# EAGLE board UCirKitBreadboardWithEverything2Top (EAGLE 7.3.0), part 1 of 2
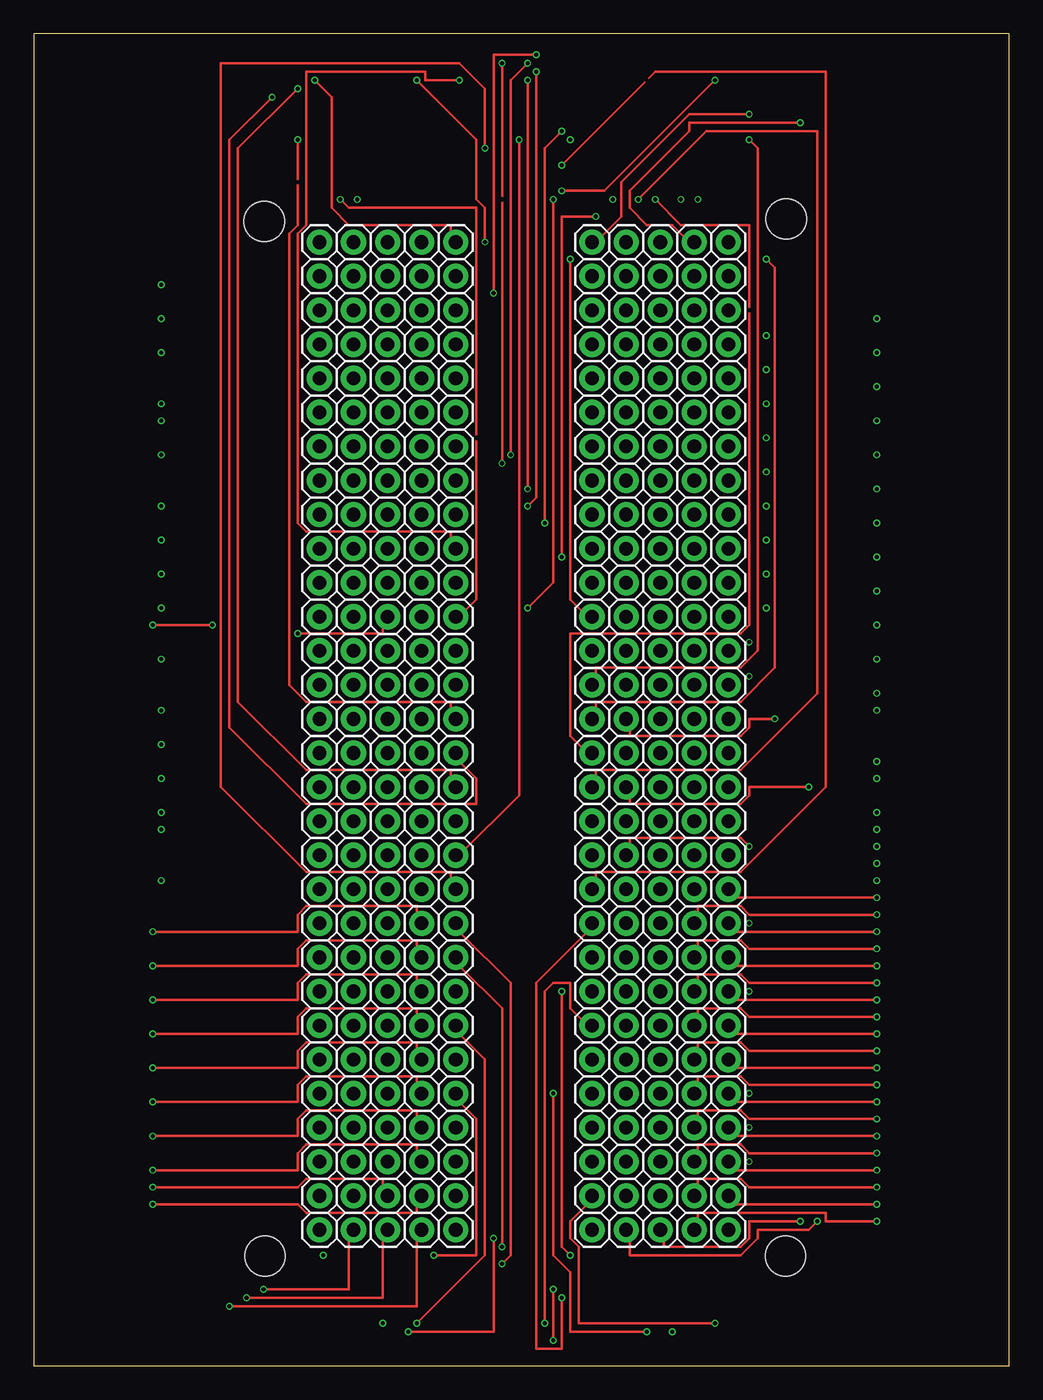
[diagram p2: board, top side]
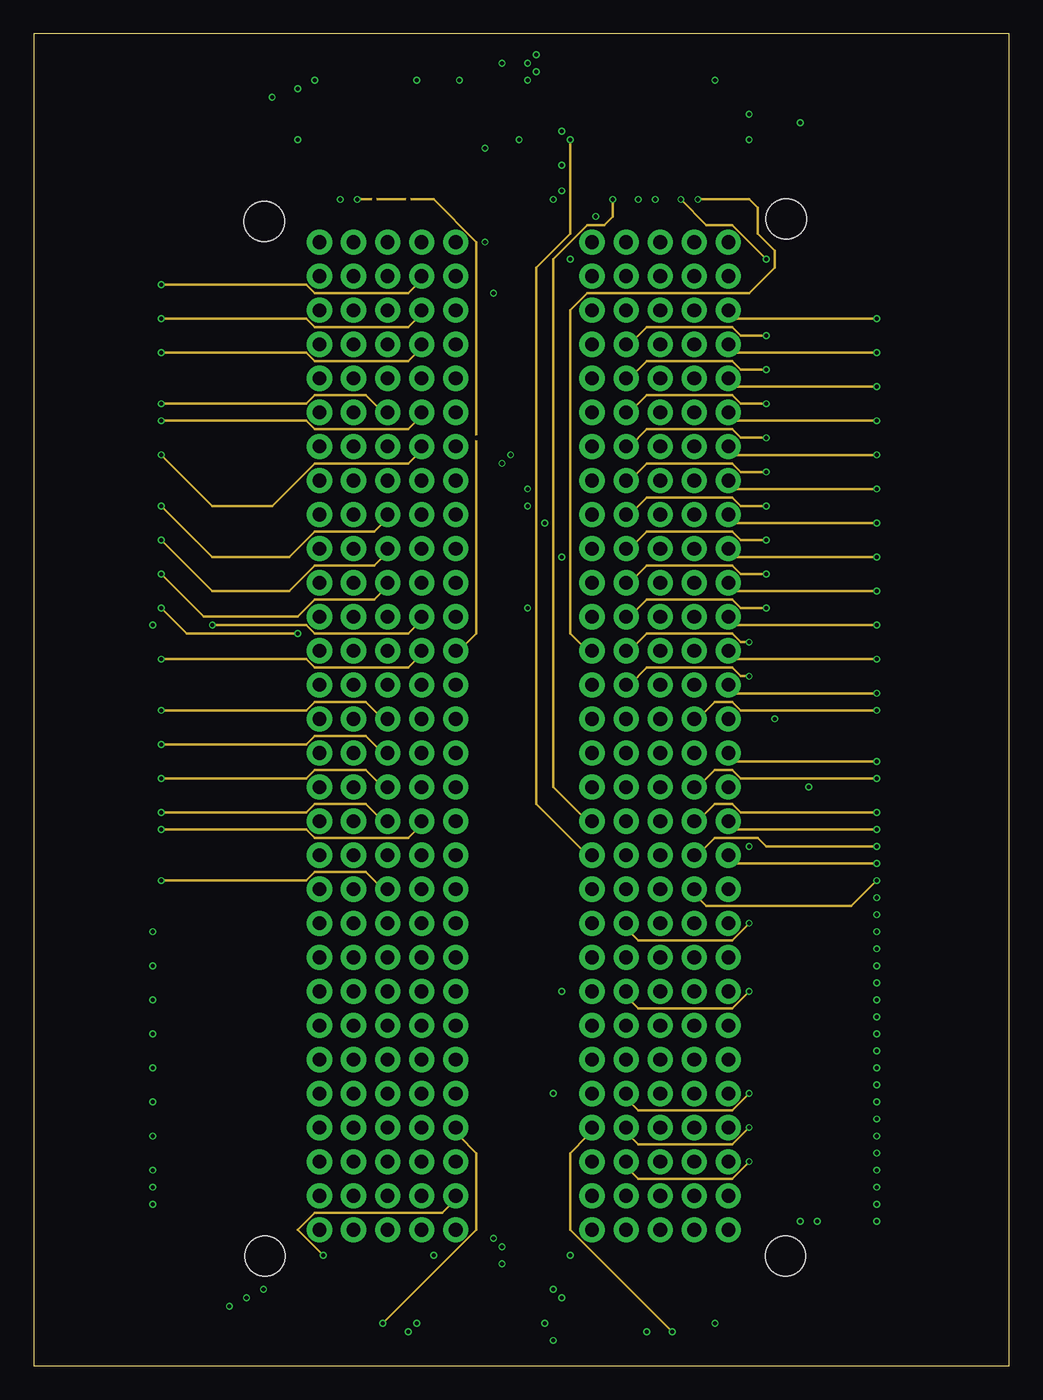
[diagram p3: board, inner layer Route2]
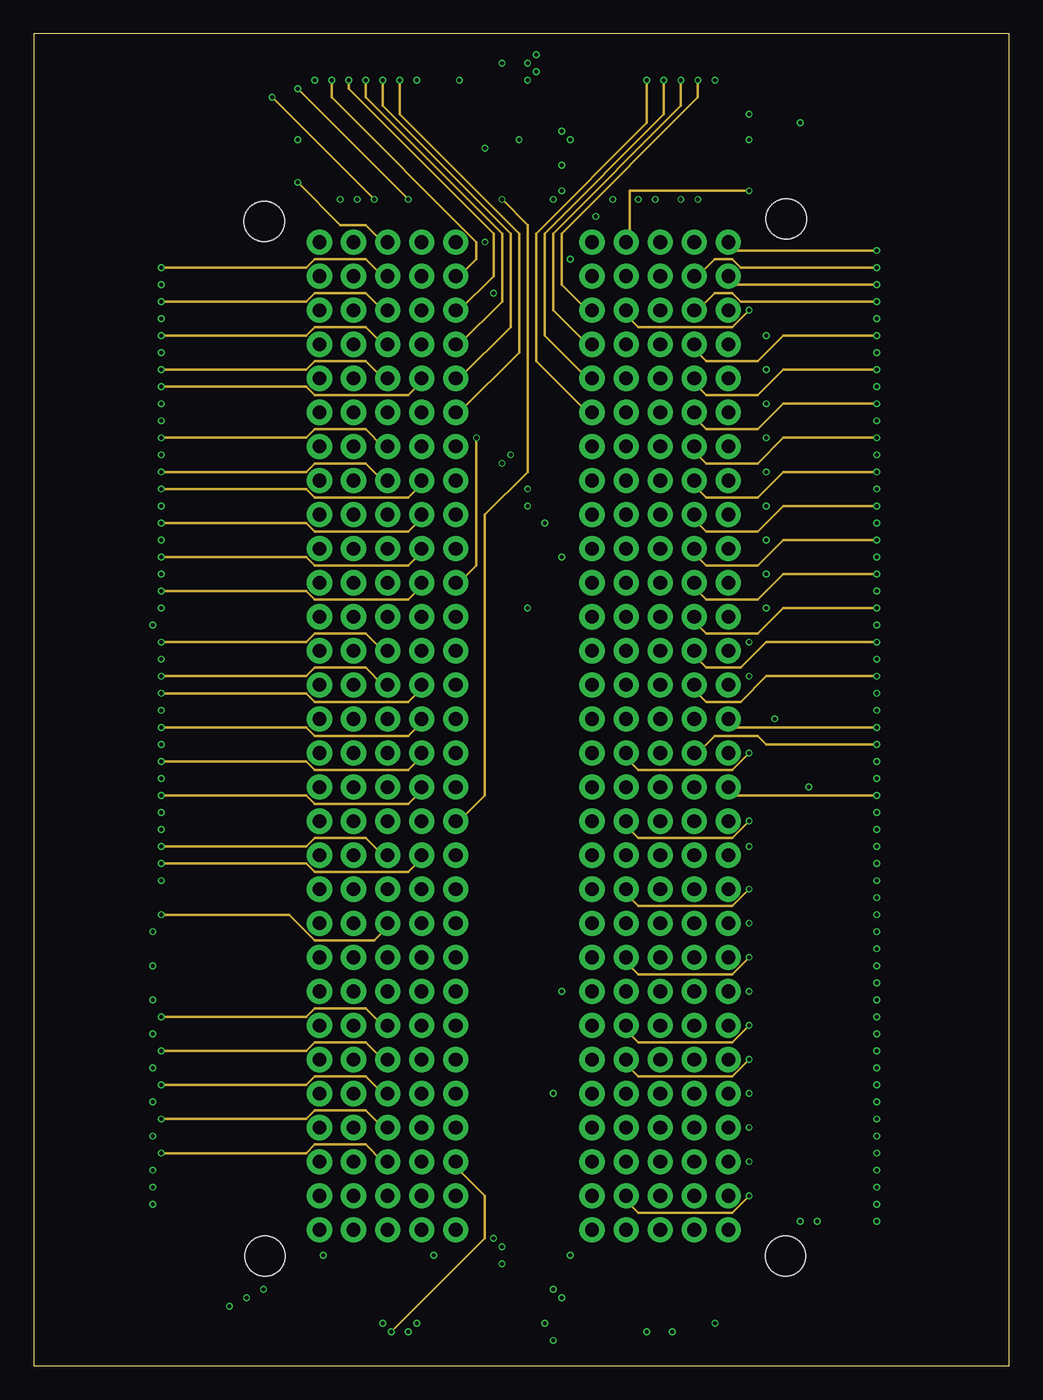
[diagram p4: board, inner layer Route15]
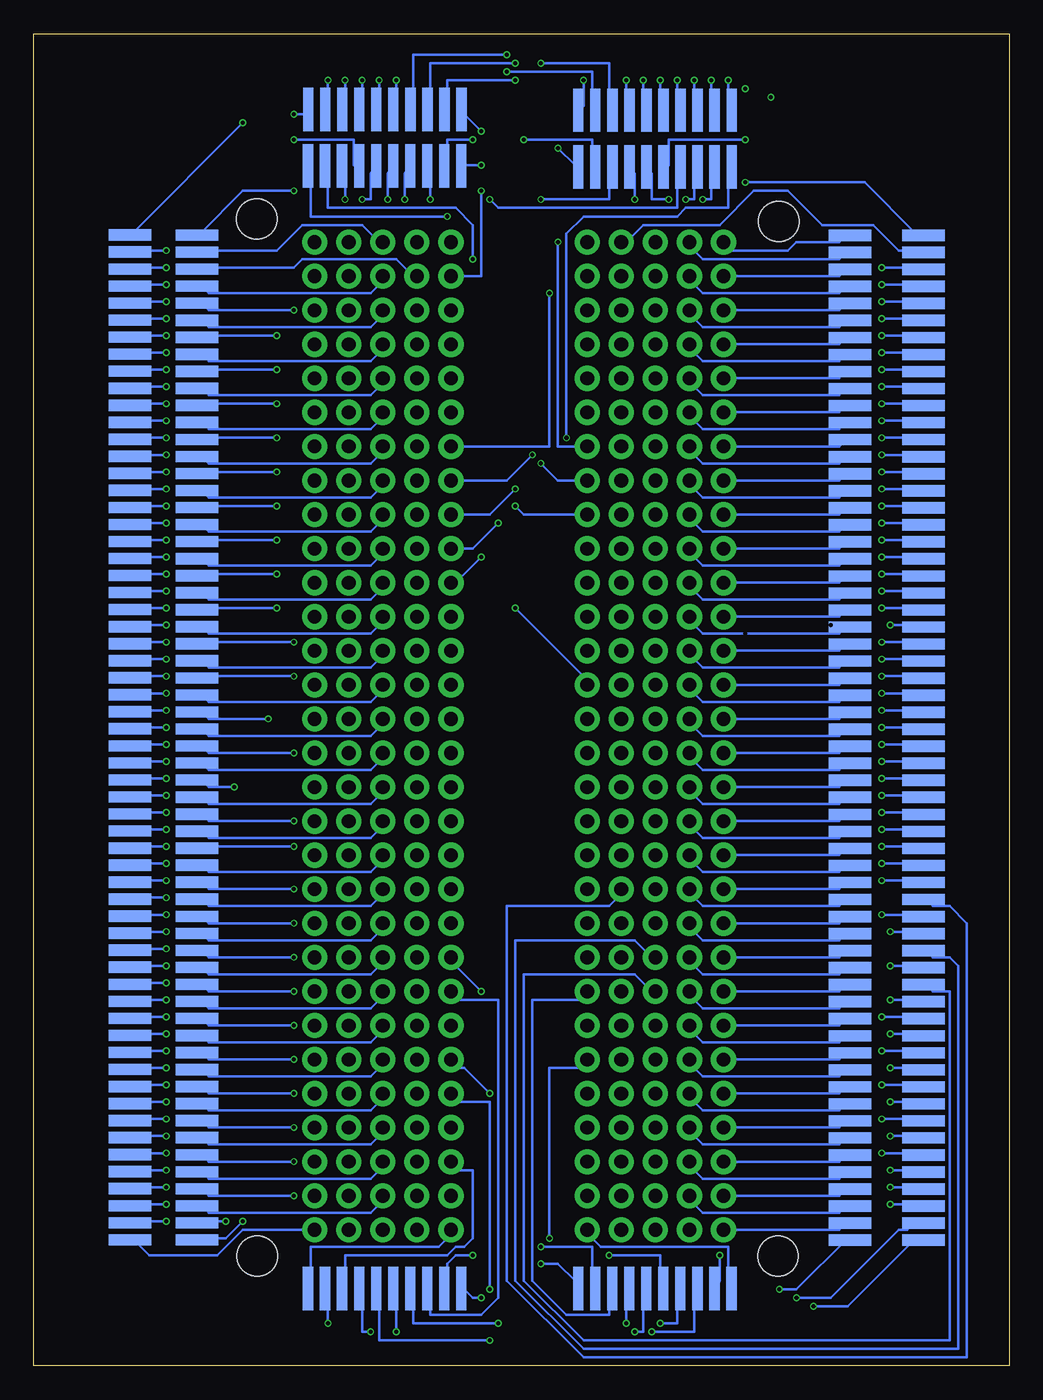
[diagram p5: board, bottom side, seen from below]

Size 72.75 x 99.36 mm. Coordinates in mm from the lower left corner, seen from the top.
Outline: 0,0 72.75,0 72.75,99.36 0,99.36 0,0
Copper layers [2:(1*(2*15)*16):15]: Top 0.035mm / dielectric 0.2mm / Route2 0.0175mm / dielectric 0.3mm / Route15 0.0175mm / dielectric 0.2mm / Bottom 0.035mm
Design rules "SeeedStudio_4layer_DRU_no_angle_20140221 *": minimum track width 8mil, minimum drill 12mil, track to track 8mil, track to pad 8mil, pad to pad 8mil, via to via 8mil, smd to smd 0mil, copper to edge 10mil, drill to drill 8mil, minimum pad ring 6mil, minimum via ring 4mil, stop-mask expansion 4mil, vias tented up to drill 100mil, thermal gap 10mil
Holes 3 mm at 56.11,85.53 17.2,85.34 17.24,8.21 56.07,8.21

## Footprints (pad centres in the part's own frame; a part is rotated, then mirrored left to right if it is on the bottom)
1X01_WITHOUT_TEXT = drill 1.016 pad 1.88: 1 0,0
1X01_SMD_3.25X0.85MM_NO_SILK = smd 3.25 x 0.85: P$3 0,0

## Placement (x,y rotation side)
CLEAN0  [1X01_WITHOUT_TEXT]  21.32,83.81 0 top
CLEAN1  [1X01_WITHOUT_TEXT]  23.86,83.81 0 top
CLEAN2  [1X01_WITHOUT_TEXT]  26.39,83.81 0 top
CLEAN3  [1X01_WITHOUT_TEXT]  28.93,83.81 0 top
CLEAN4  [1X01_WITHOUT_TEXT]  31.48,83.81 0 top
CLEAN5  [1X01_WITHOUT_TEXT]  41.63,83.81 0 top
CLEAN6  [1X01_WITHOUT_TEXT]  44.17,83.81 0 top
CLEAN7  [1X01_WITHOUT_TEXT]  46.72,83.81 0 top
CLEAN8  [1X01_WITHOUT_TEXT]  49.26,83.81 0 top
CLEAN9  [1X01_WITHOUT_TEXT]  51.8,83.81 0 top
CLEAN10  [1X01_WITHOUT_TEXT]  21.32,81.27 0 top
CLEAN11  [1X01_WITHOUT_TEXT]  23.86,81.27 0 top
CLEAN12  [1X01_WITHOUT_TEXT]  26.39,81.27 0 top
CLEAN13  [1X01_WITHOUT_TEXT]  28.93,81.27 0 top
CLEAN14  [1X01_WITHOUT_TEXT]  31.48,81.27 0 top
CLEAN15  [1X01_WITHOUT_TEXT]  41.63,81.27 0 top
CLEAN16  [1X01_WITHOUT_TEXT]  44.17,81.27 0 top
CLEAN17  [1X01_WITHOUT_TEXT]  46.72,81.27 0 top
CLEAN18  [1X01_WITHOUT_TEXT]  49.26,81.27 0 top
CLEAN19  [1X01_WITHOUT_TEXT]  51.8,81.27 0 top
CLEAN20  [1X01_WITHOUT_TEXT]  21.32,78.73 0 top
CLEAN21  [1X01_WITHOUT_TEXT]  23.86,78.73 0 top
CLEAN22  [1X01_WITHOUT_TEXT]  26.39,78.73 0 top
CLEAN23  [1X01_WITHOUT_TEXT]  28.93,78.73 0 top
CLEAN24  [1X01_WITHOUT_TEXT]  31.48,78.73 0 top
CLEAN25  [1X01_WITHOUT_TEXT]  41.63,78.73 0 top
CLEAN26  [1X01_WITHOUT_TEXT]  44.17,78.73 0 top
CLEAN27  [1X01_WITHOUT_TEXT]  46.72,78.73 0 top
CLEAN28  [1X01_WITHOUT_TEXT]  49.26,78.73 0 top
CLEAN29  [1X01_WITHOUT_TEXT]  51.8,78.73 0 top
CLEAN30  [1X01_WITHOUT_TEXT]  21.32,76.19 0 top
CLEAN31  [1X01_WITHOUT_TEXT]  23.86,76.19 0 top
CLEAN32  [1X01_WITHOUT_TEXT]  26.39,76.19 0 top
CLEAN33  [1X01_WITHOUT_TEXT]  28.93,76.19 0 top
CLEAN34  [1X01_WITHOUT_TEXT]  31.48,76.19 0 top
CLEAN35  [1X01_WITHOUT_TEXT]  41.63,76.19 0 top
CLEAN36  [1X01_WITHOUT_TEXT]  44.17,76.19 0 top
CLEAN37  [1X01_WITHOUT_TEXT]  46.72,76.19 0 top
CLEAN38  [1X01_WITHOUT_TEXT]  49.26,76.19 0 top
CLEAN39  [1X01_WITHOUT_TEXT]  51.8,76.19 0 top
CLEAN40  [1X01_WITHOUT_TEXT]  21.32,73.65 0 top
CLEAN41  [1X01_WITHOUT_TEXT]  23.86,73.65 0 top
CLEAN42  [1X01_WITHOUT_TEXT]  26.39,73.65 0 top
CLEAN43  [1X01_WITHOUT_TEXT]  28.93,73.65 0 top
CLEAN44  [1X01_WITHOUT_TEXT]  31.48,73.65 0 top
CLEAN45  [1X01_WITHOUT_TEXT]  41.63,73.65 0 top
CLEAN46  [1X01_WITHOUT_TEXT]  44.17,73.65 0 top
CLEAN47  [1X01_WITHOUT_TEXT]  46.72,73.65 0 top
CLEAN48  [1X01_WITHOUT_TEXT]  49.26,73.65 0 top
CLEAN49  [1X01_WITHOUT_TEXT]  51.8,73.65 0 top
CLEAN50  [1X01_WITHOUT_TEXT]  21.32,71.11 0 top
CLEAN51  [1X01_WITHOUT_TEXT]  23.86,71.11 0 top
CLEAN52  [1X01_WITHOUT_TEXT]  26.39,71.11 0 top
CLEAN53  [1X01_WITHOUT_TEXT]  28.93,71.11 0 top
CLEAN54  [1X01_WITHOUT_TEXT]  31.48,71.11 0 top
CLEAN55  [1X01_WITHOUT_TEXT]  41.63,71.11 0 top
CLEAN56  [1X01_WITHOUT_TEXT]  44.17,71.11 0 top
CLEAN57  [1X01_WITHOUT_TEXT]  46.72,71.11 0 top
CLEAN58  [1X01_WITHOUT_TEXT]  49.26,71.11 0 top
CLEAN59  [1X01_WITHOUT_TEXT]  51.8,71.11 0 top
CLEAN60  [1X01_WITHOUT_TEXT]  21.32,68.57 0 top
CLEAN61  [1X01_WITHOUT_TEXT]  23.86,68.57 0 top
CLEAN62  [1X01_WITHOUT_TEXT]  26.39,68.57 0 top
CLEAN63  [1X01_WITHOUT_TEXT]  28.93,68.57 0 top
CLEAN64  [1X01_WITHOUT_TEXT]  31.48,68.57 0 top
CLEAN65  [1X01_WITHOUT_TEXT]  41.63,68.57 0 top
CLEAN66  [1X01_WITHOUT_TEXT]  44.17,68.57 0 top
CLEAN67  [1X01_WITHOUT_TEXT]  46.72,68.57 0 top
CLEAN68  [1X01_WITHOUT_TEXT]  49.26,68.57 0 top
CLEAN69  [1X01_WITHOUT_TEXT]  51.8,68.57 0 top
CLEAN70  [1X01_WITHOUT_TEXT]  21.32,66.03 0 top
CLEAN71  [1X01_WITHOUT_TEXT]  23.86,66.03 0 top
CLEAN72  [1X01_WITHOUT_TEXT]  26.39,66.03 0 top
CLEAN73  [1X01_WITHOUT_TEXT]  28.93,66.03 0 top
CLEAN74  [1X01_WITHOUT_TEXT]  31.48,66.03 0 top
CLEAN75  [1X01_WITHOUT_TEXT]  41.63,66.03 0 top
CLEAN76  [1X01_WITHOUT_TEXT]  44.17,66.03 0 top
CLEAN77  [1X01_WITHOUT_TEXT]  46.72,66.03 0 top
CLEAN78  [1X01_WITHOUT_TEXT]  49.26,66.03 0 top
CLEAN79  [1X01_WITHOUT_TEXT]  51.8,66.03 0 top
CLEAN80  [1X01_WITHOUT_TEXT]  21.32,63.49 0 top
CLEAN81  [1X01_WITHOUT_TEXT]  23.86,63.49 0 top
CLEAN82  [1X01_WITHOUT_TEXT]  26.39,63.49 0 top
CLEAN83  [1X01_WITHOUT_TEXT]  28.93,63.49 0 top
CLEAN84  [1X01_WITHOUT_TEXT]  31.48,63.49 0 top
CLEAN85  [1X01_WITHOUT_TEXT]  41.63,63.49 0 top
CLEAN86  [1X01_WITHOUT_TEXT]  44.17,63.49 0 top
CLEAN87  [1X01_WITHOUT_TEXT]  46.72,63.49 0 top
CLEAN88  [1X01_WITHOUT_TEXT]  49.26,63.49 0 top
CLEAN89  [1X01_WITHOUT_TEXT]  51.8,63.49 0 top
CLEAN90  [1X01_WITHOUT_TEXT]  21.32,60.95 0 top
CLEAN91  [1X01_WITHOUT_TEXT]  23.86,60.95 0 top
CLEAN92  [1X01_WITHOUT_TEXT]  26.39,60.95 0 top
CLEAN93  [1X01_WITHOUT_TEXT]  28.93,60.95 0 top
CLEAN94  [1X01_WITHOUT_TEXT]  31.48,60.95 0 top
CLEAN95  [1X01_WITHOUT_TEXT]  41.63,60.95 0 top
CLEAN96  [1X01_WITHOUT_TEXT]  44.17,60.95 0 top
CLEAN97  [1X01_WITHOUT_TEXT]  46.72,60.95 0 top
CLEAN98  [1X01_WITHOUT_TEXT]  49.26,60.95 0 top
CLEAN99  [1X01_WITHOUT_TEXT]  51.8,60.95 0 top
CLEAN100  [1X01_WITHOUT_TEXT]  21.32,58.41 0 top
CLEAN101  [1X01_WITHOUT_TEXT]  23.86,58.41 0 top
CLEAN102  [1X01_WITHOUT_TEXT]  26.39,58.41 0 top
CLEAN103  [1X01_WITHOUT_TEXT]  28.93,58.41 0 top
CLEAN104  [1X01_WITHOUT_TEXT]  31.48,58.41 0 top
CLEAN105  [1X01_WITHOUT_TEXT]  41.63,58.41 0 top
CLEAN106  [1X01_WITHOUT_TEXT]  44.17,58.41 0 top
CLEAN107  [1X01_WITHOUT_TEXT]  46.72,58.41 0 top
CLEAN108  [1X01_WITHOUT_TEXT]  49.26,58.41 0 top
CLEAN109  [1X01_WITHOUT_TEXT]  51.8,58.41 0 top
CLEAN110  [1X01_WITHOUT_TEXT]  21.32,55.87 0 top
CLEAN111  [1X01_WITHOUT_TEXT]  23.86,55.87 0 top
CLEAN112  [1X01_WITHOUT_TEXT]  26.39,55.87 0 top
CLEAN113  [1X01_WITHOUT_TEXT]  28.93,55.87 0 top
CLEAN114  [1X01_WITHOUT_TEXT]  31.48,55.87 0 top
CLEAN115  [1X01_WITHOUT_TEXT]  41.63,55.87 0 top
CLEAN116  [1X01_WITHOUT_TEXT]  44.17,55.87 0 top
CLEAN117  [1X01_WITHOUT_TEXT]  46.72,55.87 0 top
CLEAN118  [1X01_WITHOUT_TEXT]  49.26,55.87 0 top
CLEAN119  [1X01_WITHOUT_TEXT]  51.8,55.87 0 top
CLEAN120  [1X01_WITHOUT_TEXT]  21.32,53.33 0 top
CLEAN121  [1X01_WITHOUT_TEXT]  23.86,53.33 0 top
CLEAN122  [1X01_WITHOUT_TEXT]  26.39,53.33 0 top
CLEAN123  [1X01_WITHOUT_TEXT]  28.93,53.33 0 top
CLEAN124  [1X01_WITHOUT_TEXT]  31.48,53.33 0 top
CLEAN125  [1X01_WITHOUT_TEXT]  41.63,53.33 0 top
CLEAN126  [1X01_WITHOUT_TEXT]  44.17,53.33 0 top
CLEAN127  [1X01_WITHOUT_TEXT]  46.72,53.33 0 top
CLEAN128  [1X01_WITHOUT_TEXT]  49.26,53.33 0 top
CLEAN129  [1X01_WITHOUT_TEXT]  51.8,53.33 0 top
CLEAN130  [1X01_WITHOUT_TEXT]  21.32,50.79 0 top
CLEAN131  [1X01_WITHOUT_TEXT]  23.86,50.79 0 top
CLEAN132  [1X01_WITHOUT_TEXT]  26.39,50.79 0 top
CLEAN133  [1X01_WITHOUT_TEXT]  28.93,50.79 0 top
CLEAN134  [1X01_WITHOUT_TEXT]  31.48,50.79 0 top
CLEAN135  [1X01_WITHOUT_TEXT]  41.63,50.79 0 top
CLEAN136  [1X01_WITHOUT_TEXT]  44.17,50.79 0 top
CLEAN137  [1X01_WITHOUT_TEXT]  46.72,50.79 0 top
CLEAN138  [1X01_WITHOUT_TEXT]  49.26,50.79 0 top
CLEAN139  [1X01_WITHOUT_TEXT]  51.8,50.79 0 top
CLEAN140  [1X01_WITHOUT_TEXT]  21.32,48.25 0 top
CLEAN141  [1X01_WITHOUT_TEXT]  23.86,48.25 0 top
CLEAN142  [1X01_WITHOUT_TEXT]  26.39,48.25 0 top
CLEAN143  [1X01_WITHOUT_TEXT]  28.93,48.25 0 top
CLEAN144  [1X01_WITHOUT_TEXT]  31.48,48.25 0 top
CLEAN145  [1X01_WITHOUT_TEXT]  41.63,48.25 0 top
CLEAN146  [1X01_WITHOUT_TEXT]  44.17,48.25 0 top
CLEAN147  [1X01_WITHOUT_TEXT]  46.72,48.25 0 top
CLEAN148  [1X01_WITHOUT_TEXT]  49.26,48.25 0 top
CLEAN149  [1X01_WITHOUT_TEXT]  51.8,48.25 0 top
CLEAN150  [1X01_WITHOUT_TEXT]  21.32,45.71 0 top
CLEAN151  [1X01_WITHOUT_TEXT]  23.86,45.71 0 top
CLEAN152  [1X01_WITHOUT_TEXT]  26.39,45.71 0 top
CLEAN153  [1X01_WITHOUT_TEXT]  28.93,45.71 0 top
CLEAN154  [1X01_WITHOUT_TEXT]  31.48,45.71 0 top
CLEAN155  [1X01_WITHOUT_TEXT]  41.63,45.71 0 top
CLEAN156  [1X01_WITHOUT_TEXT]  44.17,45.71 0 top
CLEAN157  [1X01_WITHOUT_TEXT]  46.72,45.71 0 top
CLEAN158  [1X01_WITHOUT_TEXT]  49.26,45.71 0 top
CLEAN159  [1X01_WITHOUT_TEXT]  51.8,45.71 0 top
CLEAN160  [1X01_WITHOUT_TEXT]  21.32,43.17 0 top
CLEAN161  [1X01_WITHOUT_TEXT]  23.86,43.17 0 top
CLEAN162  [1X01_WITHOUT_TEXT]  26.39,43.17 0 top
CLEAN163  [1X01_WITHOUT_TEXT]  28.93,43.17 0 top
CLEAN164  [1X01_WITHOUT_TEXT]  31.48,43.17 0 top
CLEAN165  [1X01_WITHOUT_TEXT]  41.63,43.17 0 top
CLEAN166  [1X01_WITHOUT_TEXT]  44.17,43.17 0 top
CLEAN167  [1X01_WITHOUT_TEXT]  46.72,43.17 0 top
CLEAN168  [1X01_WITHOUT_TEXT]  49.26,43.17 0 top
CLEAN169  [1X01_WITHOUT_TEXT]  51.8,43.17 0 top
CLEAN170  [1X01_WITHOUT_TEXT]  21.32,40.63 0 top
CLEAN171  [1X01_WITHOUT_TEXT]  23.86,40.63 0 top
CLEAN172  [1X01_WITHOUT_TEXT]  26.39,40.63 0 top
CLEAN173  [1X01_WITHOUT_TEXT]  28.93,40.63 0 top
CLEAN174  [1X01_WITHOUT_TEXT]  31.48,40.63 0 top
CLEAN175  [1X01_WITHOUT_TEXT]  41.63,40.63 0 top
CLEAN176  [1X01_WITHOUT_TEXT]  44.17,40.63 0 top
CLEAN177  [1X01_WITHOUT_TEXT]  46.72,40.63 0 top
CLEAN178  [1X01_WITHOUT_TEXT]  49.26,40.63 0 top
CLEAN179  [1X01_WITHOUT_TEXT]  51.8,40.63 0 top
CLEAN180  [1X01_WITHOUT_TEXT]  21.32,38.09 0 top
CLEAN181  [1X01_WITHOUT_TEXT]  23.86,38.09 0 top
CLEAN182  [1X01_WITHOUT_TEXT]  26.39,38.09 0 top
CLEAN183  [1X01_WITHOUT_TEXT]  28.93,38.09 0 top
CLEAN184  [1X01_WITHOUT_TEXT]  31.48,38.09 0 top
CLEAN185  [1X01_WITHOUT_TEXT]  41.63,38.09 0 top
CLEAN186  [1X01_WITHOUT_TEXT]  44.17,38.09 0 top
CLEAN187  [1X01_WITHOUT_TEXT]  46.72,38.09 0 top
CLEAN188  [1X01_WITHOUT_TEXT]  49.26,38.09 0 top
CLEAN189  [1X01_WITHOUT_TEXT]  51.8,38.09 0 top
CLEAN190  [1X01_WITHOUT_TEXT]  21.32,35.55 0 top
CLEAN191  [1X01_WITHOUT_TEXT]  23.86,35.55 0 top
CLEAN192  [1X01_WITHOUT_TEXT]  26.39,35.55 0 top
CLEAN193  [1X01_WITHOUT_TEXT]  28.93,35.55 0 top
CLEAN194  [1X01_WITHOUT_TEXT]  31.48,35.55 0 top
CLEAN195  [1X01_WITHOUT_TEXT]  41.63,35.55 0 top
CLEAN196  [1X01_WITHOUT_TEXT]  44.17,35.55 0 top
CLEAN197  [1X01_WITHOUT_TEXT]  46.72,35.55 0 top
CLEAN198  [1X01_WITHOUT_TEXT]  49.26,35.55 0 top
CLEAN199  [1X01_WITHOUT_TEXT]  51.8,35.55 0 top
CLEAN200  [1X01_WITHOUT_TEXT]  21.32,33.01 0 top
CLEAN201  [1X01_WITHOUT_TEXT]  23.86,33.01 0 top
CLEAN202  [1X01_WITHOUT_TEXT]  26.39,33.01 0 top
CLEAN203  [1X01_WITHOUT_TEXT]  28.93,33.01 0 top
CLEAN204  [1X01_WITHOUT_TEXT]  31.48,33.01 0 top
CLEAN205  [1X01_WITHOUT_TEXT]  41.63,33.01 0 top
CLEAN206  [1X01_WITHOUT_TEXT]  44.17,33.01 0 top
CLEAN207  [1X01_WITHOUT_TEXT]  46.72,33.01 0 top
CLEAN208  [1X01_WITHOUT_TEXT]  49.26,33.01 0 top
CLEAN209  [1X01_WITHOUT_TEXT]  51.8,33.01 0 top
CLEAN210  [1X01_WITHOUT_TEXT]  21.32,30.47 0 top
CLEAN211  [1X01_WITHOUT_TEXT]  23.86,30.47 0 top
CLEAN212  [1X01_WITHOUT_TEXT]  26.39,30.47 0 top
CLEAN213  [1X01_WITHOUT_TEXT]  28.93,30.47 0 top
CLEAN214  [1X01_WITHOUT_TEXT]  31.48,30.47 0 top
CLEAN215  [1X01_WITHOUT_TEXT]  41.63,30.47 0 top
CLEAN216  [1X01_WITHOUT_TEXT]  44.17,30.47 0 top
CLEAN217  [1X01_WITHOUT_TEXT]  46.72,30.47 0 top
CLEAN218  [1X01_WITHOUT_TEXT]  49.26,30.47 0 top
CLEAN219  [1X01_WITHOUT_TEXT]  51.8,30.47 0 top
CLEAN220  [1X01_WITHOUT_TEXT]  21.32,27.93 0 top
CLEAN221  [1X01_WITHOUT_TEXT]  23.86,27.93 0 top
CLEAN222  [1X01_WITHOUT_TEXT]  26.39,27.93 0 top
CLEAN223  [1X01_WITHOUT_TEXT]  28.93,27.93 0 top
CLEAN224  [1X01_WITHOUT_TEXT]  31.48,27.93 0 top
CLEAN225  [1X01_WITHOUT_TEXT]  41.63,27.93 0 top
CLEAN226  [1X01_WITHOUT_TEXT]  44.17,27.93 0 top
CLEAN227  [1X01_WITHOUT_TEXT]  46.72,27.93 0 top
CLEAN228  [1X01_WITHOUT_TEXT]  49.26,27.93 0 top
CLEAN229  [1X01_WITHOUT_TEXT]  51.8,27.93 0 top
CLEAN230  [1X01_WITHOUT_TEXT]  21.32,25.39 0 top
CLEAN231  [1X01_WITHOUT_TEXT]  23.86,25.39 0 top
CLEAN232  [1X01_WITHOUT_TEXT]  26.39,25.39 0 top
CLEAN233  [1X01_WITHOUT_TEXT]  28.93,25.39 0 top
CLEAN234  [1X01_WITHOUT_TEXT]  31.48,25.39 0 top
CLEAN235  [1X01_WITHOUT_TEXT]  41.63,25.39 0 top
CLEAN236  [1X01_WITHOUT_TEXT]  44.17,25.39 0 top
CLEAN237  [1X01_WITHOUT_TEXT]  46.72,25.39 0 top
CLEAN238  [1X01_WITHOUT_TEXT]  49.26,25.39 0 top
CLEAN239  [1X01_WITHOUT_TEXT]  51.8,25.39 0 top
CLEAN240  [1X01_WITHOUT_TEXT]  21.32,22.85 0 top
CLEAN241  [1X01_WITHOUT_TEXT]  23.86,22.85 0 top
CLEAN242  [1X01_WITHOUT_TEXT]  26.39,22.85 0 top
CLEAN243  [1X01_WITHOUT_TEXT]  28.93,22.85 0 top
CLEAN244  [1X01_WITHOUT_TEXT]  31.48,22.85 0 top
CLEAN245  [1X01_WITHOUT_TEXT]  41.63,22.85 0 top
CLEAN246  [1X01_WITHOUT_TEXT]  44.17,22.85 0 top
CLEAN247  [1X01_WITHOUT_TEXT]  46.72,22.85 0 top
CLEAN248  [1X01_WITHOUT_TEXT]  49.26,22.85 0 top
CLEAN249  [1X01_WITHOUT_TEXT]  51.8,22.85 0 top
CLEAN250  [1X01_WITHOUT_TEXT]  21.32,20.31 0 top
CLEAN251  [1X01_WITHOUT_TEXT]  23.86,20.31 0 top
CLEAN252  [1X01_WITHOUT_TEXT]  26.39,20.31 0 top
CLEAN253  [1X01_WITHOUT_TEXT]  28.93,20.31 0 top
CLEAN254  [1X01_WITHOUT_TEXT]  31.48,20.31 0 top
CLEAN255  [1X01_WITHOUT_TEXT]  41.63,20.31 0 top
CLEAN256  [1X01_WITHOUT_TEXT]  44.17,20.31 0 top
CLEAN257  [1X01_WITHOUT_TEXT]  46.72,20.31 0 top
CLEAN258  [1X01_WITHOUT_TEXT]  49.26,20.31 0 top
CLEAN259  [1X01_WITHOUT_TEXT]  51.8,20.31 0 top
CLEAN260  [1X01_WITHOUT_TEXT]  21.32,17.77 0 top
CLEAN261  [1X01_WITHOUT_TEXT]  23.86,17.77 0 top
CLEAN262  [1X01_WITHOUT_TEXT]  26.39,17.77 0 top
CLEAN263  [1X01_WITHOUT_TEXT]  28.93,17.77 0 top
CLEAN264  [1X01_WITHOUT_TEXT]  31.48,17.77 0 top
CLEAN265  [1X01_WITHOUT_TEXT]  41.63,17.77 0 top
CLEAN266  [1X01_WITHOUT_TEXT]  44.17,17.77 0 top
CLEAN267  [1X01_WITHOUT_TEXT]  46.72,17.77 0 top
CLEAN268  [1X01_WITHOUT_TEXT]  49.26,17.77 0 top
CLEAN269  [1X01_WITHOUT_TEXT]  51.8,17.77 0 top
CLEAN270  [1X01_WITHOUT_TEXT]  21.32,15.23 0 top
CLEAN271  [1X01_WITHOUT_TEXT]  23.86,15.23 0 top
CLEAN272  [1X01_WITHOUT_TEXT]  26.39,15.23 0 top
CLEAN273  [1X01_WITHOUT_TEXT]  28.93,15.23 0 top
CLEAN274  [1X01_WITHOUT_TEXT]  31.48,15.23 0 top
CLEAN275  [1X01_WITHOUT_TEXT]  41.63,15.23 0 top
CLEAN276  [1X01_WITHOUT_TEXT]  44.17,15.23 0 top
CLEAN277  [1X01_WITHOUT_TEXT]  46.72,15.23 0 top
CLEAN278  [1X01_WITHOUT_TEXT]  49.26,15.23 0 top
CLEAN279  [1X01_WITHOUT_TEXT]  51.8,15.23 0 top
CLEAN280  [1X01_WITHOUT_TEXT]  21.32,12.69 0 top
CLEAN281  [1X01_WITHOUT_TEXT]  23.86,12.69 0 top
CLEAN282  [1X01_WITHOUT_TEXT]  26.39,12.69 0 top
CLEAN283  [1X01_WITHOUT_TEXT]  28.93,12.69 0 top
CLEAN284  [1X01_WITHOUT_TEXT]  31.48,12.69 0 top
CLEAN285  [1X01_WITHOUT_TEXT]  41.63,12.69 0 top
CLEAN286  [1X01_WITHOUT_TEXT]  44.17,12.69 0 top
CLEAN287  [1X01_WITHOUT_TEXT]  46.72,12.69 0 top
CLEAN288  [1X01_WITHOUT_TEXT]  49.26,12.69 0 top
CLEAN289  [1X01_WITHOUT_TEXT]  51.8,12.69 0 top
CLEAN290  [1X01_WITHOUT_TEXT]  21.32,10.15 0 top
CLEAN291  [1X01_WITHOUT_TEXT]  23.86,10.15 0 top
CLEAN292  [1X01_WITHOUT_TEXT]  26.39,10.15 0 top
CLEAN293  [1X01_WITHOUT_TEXT]  28.93,10.15 0 top
CLEAN294  [1X01_WITHOUT_TEXT]  31.48,10.15 0 top
CLEAN295  [1X01_WITHOUT_TEXT]  41.63,10.15 0 top
CLEAN296  [1X01_WITHOUT_TEXT]  44.17,10.15 0 top
CLEAN297  [1X01_WITHOUT_TEXT]  46.72,10.15 0 top
CLEAN298  [1X01_WITHOUT_TEXT]  49.26,10.15 0 top
CLEAN299  [1X01_WITHOUT_TEXT]  51.8,10.15 0 top
CLEAN300  [1X01_SMD_3.25X0.85MM_NO_SILK]  11.9,84.31 0 bottom
CLEAN301  [1X01_SMD_3.25X0.85MM_NO_SILK]  11.9,83.04 0 bottom
CLEAN302  [1X01_SMD_3.25X0.85MM_NO_SILK]  11.9,81.77 0 bottom
CLEAN303  [1X01_SMD_3.25X0.85MM_NO_SILK]  11.9,80.5 0 bottom
CLEAN304  [1X01_SMD_3.25X0.85MM_NO_SILK]  11.9,79.23 0 bottom
CLEAN305  [1X01_SMD_3.25X0.85MM_NO_SILK]  11.9,77.96 0 bottom
CLEAN306  [1X01_SMD_3.25X0.85MM_NO_SILK]  11.9,76.69 0 bottom
CLEAN307  [1X01_SMD_3.25X0.85MM_NO_SILK]  11.9,75.42 0 bottom
CLEAN308  [1X01_SMD_3.25X0.85MM_NO_SILK]  11.9,74.15 0 bottom
CLEAN309  [1X01_SMD_3.25X0.85MM_NO_SILK]  11.9,72.88 0 bottom
CLEAN310  [1X01_SMD_3.25X0.85MM_NO_SILK]  11.9,71.61 0 bottom
CLEAN311  [1X01_SMD_3.25X0.85MM_NO_SILK]  11.9,70.34 0 bottom
CLEAN312  [1X01_SMD_3.25X0.85MM_NO_SILK]  11.9,69.07 0 bottom
CLEAN313  [1X01_SMD_3.25X0.85MM_NO_SILK]  11.9,67.8 0 bottom
CLEAN314  [1X01_SMD_3.25X0.85MM_NO_SILK]  11.9,66.53 0 bottom
CLEAN315  [1X01_SMD_3.25X0.85MM_NO_SILK]  11.9,65.26 0 bottom
CLEAN316  [1X01_SMD_3.25X0.85MM_NO_SILK]  11.9,63.99 0 bottom
CLEAN317  [1X01_SMD_3.25X0.85MM_NO_SILK]  11.9,62.72 0 bottom
CLEAN318  [1X01_SMD_3.25X0.85MM_NO_SILK]  11.9,61.45 0 bottom
CLEAN319  [1X01_SMD_3.25X0.85MM_NO_SILK]  11.9,60.18 0 bottom
CLEAN320  [1X01_SMD_3.25X0.85MM_NO_SILK]  11.9,58.91 0 bottom
CLEAN321  [1X01_SMD_3.25X0.85MM_NO_SILK]  11.9,57.64 0 bottom
CLEAN322  [1X01_SMD_3.25X0.85MM_NO_SILK]  11.9,56.37 0 bottom
CLEAN323  [1X01_SMD_3.25X0.85MM_NO_SILK]  11.9,55.1 0 bottom
CLEAN324  [1X01_SMD_3.25X0.85MM_NO_SILK]  11.9,53.83 0 bottom
CLEAN325  [1X01_SMD_3.25X0.85MM_NO_SILK]  11.9,52.56 0 bottom
CLEAN326  [1X01_SMD_3.25X0.85MM_NO_SILK]  11.9,51.29 0 bottom
CLEAN327  [1X01_SMD_3.25X0.85MM_NO_SILK]  11.9,50.02 0 bottom
CLEAN328  [1X01_SMD_3.25X0.85MM_NO_SILK]  11.9,48.75 0 bottom
CLEAN329  [1X01_SMD_3.25X0.85MM_NO_SILK]  11.9,47.48 0 bottom
CLEAN330  [1X01_SMD_3.25X0.85MM_NO_SILK]  11.9,46.21 0 bottom
CLEAN331  [1X01_SMD_3.25X0.85MM_NO_SILK]  11.9,44.94 0 bottom
CLEAN332  [1X01_SMD_3.25X0.85MM_NO_SILK]  11.9,43.67 0 bottom
CLEAN333  [1X01_SMD_3.25X0.85MM_NO_SILK]  11.9,42.4 0 bottom
CLEAN334  [1X01_SMD_3.25X0.85MM_NO_SILK]  11.9,41.13 0 bottom
CLEAN335  [1X01_SMD_3.25X0.85MM_NO_SILK]  11.9,39.86 0 bottom
CLEAN336  [1X01_SMD_3.25X0.85MM_NO_SILK]  11.9,38.59 0 bottom
CLEAN337  [1X01_SMD_3.25X0.85MM_NO_SILK]  11.9,37.32 0 bottom
CLEAN338  [1X01_SMD_3.25X0.85MM_NO_SILK]  11.9,36.05 0 bottom
CLEAN339  [1X01_SMD_3.25X0.85MM_NO_SILK]  11.9,34.78 0 bottom
CLEAN340  [1X01_SMD_3.25X0.85MM_NO_SILK]  11.9,33.51 0 bottom
CLEAN341  [1X01_SMD_3.25X0.85MM_NO_SILK]  11.9,32.24 0 bottom
CLEAN342  [1X01_SMD_3.25X0.85MM_NO_SILK]  11.9,30.97 0 bottom
CLEAN343  [1X01_SMD_3.25X0.85MM_NO_SILK]  11.9,29.7 0 bottom
CLEAN344  [1X01_SMD_3.25X0.85MM_NO_SILK]  11.9,28.43 0 bottom
CLEAN345  [1X01_SMD_3.25X0.85MM_NO_SILK]  11.9,27.16 0 bottom
CLEAN346  [1X01_SMD_3.25X0.85MM_NO_SILK]  11.9,25.89 0 bottom
CLEAN347  [1X01_SMD_3.25X0.85MM_NO_SILK]  11.9,24.62 0 bottom
CLEAN348  [1X01_SMD_3.25X0.85MM_NO_SILK]  11.9,23.35 0 bottom
CLEAN349  [1X01_SMD_3.25X0.85MM_NO_SILK]  11.9,22.08 0 bottom
CLEAN350  [1X01_SMD_3.25X0.85MM_NO_SILK]  11.9,20.81 0 bottom
CLEAN351  [1X01_SMD_3.25X0.85MM_NO_SILK]  11.9,19.54 0 bottom
CLEAN352  [1X01_SMD_3.25X0.85MM_NO_SILK]  11.9,18.27 0 bottom
CLEAN353  [1X01_SMD_3.25X0.85MM_NO_SILK]  11.9,17 0 bottom
CLEAN354  [1X01_SMD_3.25X0.85MM_NO_SILK]  11.9,15.73 0 bottom
CLEAN355  [1X01_SMD_3.25X0.85MM_NO_SILK]  11.9,14.46 0 bottom
CLEAN356  [1X01_SMD_3.25X0.85MM_NO_SILK]  11.9,13.19 0 bottom
CLEAN357  [1X01_SMD_3.25X0.85MM_NO_SILK]  11.9,11.92 0 bottom
CLEAN358  [1X01_SMD_3.25X0.85MM_NO_SILK]  11.9,10.65 0 bottom
CLEAN359  [1X01_SMD_3.25X0.85MM_NO_SILK]  11.9,9.38 0 bottom
CLEAN360  [1X01_SMD_3.25X0.85MM_NO_SILK]  60.58,84.33 0 bottom
CLEAN361  [1X01_SMD_3.25X0.85MM_NO_SILK]  60.58,83.06 0 bottom
CLEAN362  [1X01_SMD_3.25X0.85MM_NO_SILK]  60.58,81.79 0 bottom
CLEAN363  [1X01_SMD_3.25X0.85MM_NO_SILK]  60.58,80.52 0 bottom
CLEAN364  [1X01_SMD_3.25X0.85MM_NO_SILK]  60.58,79.25 0 bottom
CLEAN365  [1X01_SMD_3.25X0.85MM_NO_SILK]  60.58,77.98 0 bottom
CLEAN366  [1X01_SMD_3.25X0.85MM_NO_SILK]  60.58,76.71 0 bottom
CLEAN367  [1X01_SMD_3.25X0.85MM_NO_SILK]  60.58,75.44 0 bottom
CLEAN368  [1X01_SMD_3.25X0.85MM_NO_SILK]  60.58,74.17 0 bottom
CLEAN369  [1X01_SMD_3.25X0.85MM_NO_SILK]  60.58,72.9 0 bottom
CLEAN370  [1X01_SMD_3.25X0.85MM_NO_SILK]  60.58,71.63 0 bottom
CLEAN371  [1X01_SMD_3.25X0.85MM_NO_SILK]  60.58,70.36 0 bottom
CLEAN372  [1X01_SMD_3.25X0.85MM_NO_SILK]  60.58,69.09 0 bottom
CLEAN373  [1X01_SMD_3.25X0.85MM_NO_SILK]  60.58,67.82 0 bottom
CLEAN374  [1X01_SMD_3.25X0.85MM_NO_SILK]  60.58,66.55 0 bottom
CLEAN375  [1X01_SMD_3.25X0.85MM_NO_SILK]  60.58,65.28 0 bottom
CLEAN376  [1X01_SMD_3.25X0.85MM_NO_SILK]  60.58,64.01 0 bottom
CLEAN377  [1X01_SMD_3.25X0.85MM_NO_SILK]  60.58,62.74 0 bottom
CLEAN378  [1X01_SMD_3.25X0.85MM_NO_SILK]  60.58,61.47 0 bottom
CLEAN379  [1X01_SMD_3.25X0.85MM_NO_SILK]  60.58,60.2 0 bottom
CLEAN380  [1X01_SMD_3.25X0.85MM_NO_SILK]  60.58,58.93 0 bottom
CLEAN381  [1X01_SMD_3.25X0.85MM_NO_SILK]  60.58,57.66 0 bottom
CLEAN382  [1X01_SMD_3.25X0.85MM_NO_SILK]  60.58,56.39 0 bottom
CLEAN383  [1X01_SMD_3.25X0.85MM_NO_SILK]  60.58,55.12 0 bottom
CLEAN384  [1X01_SMD_3.25X0.85MM_NO_SILK]  60.58,53.85 0 bottom
CLEAN385  [1X01_SMD_3.25X0.85MM_NO_SILK]  60.58,52.58 0 bottom
CLEAN386  [1X01_SMD_3.25X0.85MM_NO_SILK]  60.58,51.31 0 bottom
CLEAN387  [1X01_SMD_3.25X0.85MM_NO_SILK]  60.58,50.04 0 bottom
CLEAN388  [1X01_SMD_3.25X0.85MM_NO_SILK]  60.58,48.77 0 bottom
CLEAN389  [1X01_SMD_3.25X0.85MM_NO_SILK]  60.58,47.5 0 bottom
CLEAN390  [1X01_SMD_3.25X0.85MM_NO_SILK]  60.58,46.23 0 bottom
CLEAN391  [1X01_SMD_3.25X0.85MM_NO_SILK]  60.58,44.96 0 bottom
CLEAN392  [1X01_SMD_3.25X0.85MM_NO_SILK]  60.58,43.69 0 bottom
CLEAN393  [1X01_SMD_3.25X0.85MM_NO_SILK]  60.58,42.42 0 bottom
CLEAN394  [1X01_SMD_3.25X0.85MM_NO_SILK]  60.58,41.15 0 bottom
CLEAN395  [1X01_SMD_3.25X0.85MM_NO_SILK]  60.58,39.88 0 bottom
CLEAN396  [1X01_SMD_3.25X0.85MM_NO_SILK]  60.58,38.61 0 bottom
CLEAN397  [1X01_SMD_3.25X0.85MM_NO_SILK]  60.58,37.34 0 bottom
CLEAN398  [1X01_SMD_3.25X0.85MM_NO_SILK]  60.58,36.07 0 bottom
CLEAN399  [1X01_SMD_3.25X0.85MM_NO_SILK]  60.58,34.8 0 bottom
CLEAN400  [1X01_SMD_3.25X0.85MM_NO_SILK]  60.58,33.53 0 bottom
CLEAN401  [1X01_SMD_3.25X0.85MM_NO_SILK]  60.58,32.26 0 bottom
CLEAN402  [1X01_SMD_3.25X0.85MM_NO_SILK]  60.58,30.99 0 bottom
CLEAN403  [1X01_SMD_3.25X0.85MM_NO_SILK]  60.58,29.72 0 bottom
CLEAN404  [1X01_SMD_3.25X0.85MM_NO_SILK]  60.58,28.45 0 bottom
CLEAN405  [1X01_SMD_3.25X0.85MM_NO_SILK]  60.58,27.18 0 bottom
CLEAN406  [1X01_SMD_3.25X0.85MM_NO_SILK]  60.58,25.91 0 bottom
CLEAN407  [1X01_SMD_3.25X0.85MM_NO_SILK]  60.58,24.64 0 bottom
CLEAN408  [1X01_SMD_3.25X0.85MM_NO_SILK]  60.58,23.37 0 bottom
CLEAN409  [1X01_SMD_3.25X0.85MM_NO_SILK]  60.58,22.1 0 bottom
CLEAN410  [1X01_SMD_3.25X0.85MM_NO_SILK]  60.58,20.83 0 bottom
CLEAN411  [1X01_SMD_3.25X0.85MM_NO_SILK]  60.58,19.56 0 bottom
CLEAN412  [1X01_SMD_3.25X0.85MM_NO_SILK]  60.58,18.29 0 bottom
CLEAN413  [1X01_SMD_3.25X0.85MM_NO_SILK]  60.58,17.02 0 bottom
CLEAN414  [1X01_SMD_3.25X0.85MM_NO_SILK]  60.58,15.75 0 bottom
CLEAN415  [1X01_SMD_3.25X0.85MM_NO_SILK]  60.58,14.48 0 bottom
CLEAN416  [1X01_SMD_3.25X0.85MM_NO_SILK]  60.58,13.21 0 bottom
CLEAN417  [1X01_SMD_3.25X0.85MM_NO_SILK]  60.58,11.94 0 bottom
CLEAN418  [1X01_SMD_3.25X0.85MM_NO_SILK]  60.58,10.67 0 bottom
CLEAN419  [1X01_SMD_3.25X0.85MM_NO_SILK]  60.58,9.4 0 bottom
CLEAN420  [1X01_SMD_3.25X0.85MM_NO_SILK]  65.56,84.34 0 bottom
CLEAN421  [1X01_SMD_3.25X0.85MM_NO_SILK]  65.56,83.07 0 bottom
CLEAN422  [1X01_SMD_3.25X0.85MM_NO_SILK]  65.56,81.8 0 bottom
CLEAN423  [1X01_SMD_3.25X0.85MM_NO_SILK]  65.56,80.53 0 bottom
CLEAN424  [1X01_SMD_3.25X0.85MM_NO_SILK]  65.56,79.26 0 bottom
CLEAN425  [1X01_SMD_3.25X0.85MM_NO_SILK]  65.56,77.99 0 bottom
CLEAN426  [1X01_SMD_3.25X0.85MM_NO_SILK]  65.56,76.72 0 bottom
CLEAN427  [1X01_SMD_3.25X0.85MM_NO_SILK]  65.56,75.45 0 bottom
CLEAN428  [1X01_SMD_3.25X0.85MM_NO_SILK]  65.56,74.18 0 bottom
CLEAN429  [1X01_SMD_3.25X0.85MM_NO_SILK]  65.56,72.91 0 bottom
CLEAN430  [1X01_SMD_3.25X0.85MM_NO_SILK]  65.56,71.64 0 bottom
CLEAN431  [1X01_SMD_3.25X0.85MM_NO_SILK]  65.56,70.37 0 bottom
CLEAN432  [1X01_SMD_3.25X0.85MM_NO_SILK]  65.56,69.1 0 bottom
CLEAN433  [1X01_SMD_3.25X0.85MM_NO_SILK]  65.56,67.83 0 bottom
CLEAN434  [1X01_SMD_3.25X0.85MM_NO_SILK]  65.56,66.56 0 bottom
CLEAN435  [1X01_SMD_3.25X0.85MM_NO_SILK]  65.56,65.29 0 bottom
CLEAN436  [1X01_SMD_3.25X0.85MM_NO_SILK]  65.56,64.02 0 bottom
CLEAN437  [1X01_SMD_3.25X0.85MM_NO_SILK]  65.56,62.75 0 bottom
CLEAN438  [1X01_SMD_3.25X0.85MM_NO_SILK]  65.56,61.48 0 bottom
CLEAN439  [1X01_SMD_3.25X0.85MM_NO_SILK]  65.56,60.21 0 bottom
CLEAN440  [1X01_SMD_3.25X0.85MM_NO_SILK]  65.56,58.94 0 bottom
CLEAN441  [1X01_SMD_3.25X0.85MM_NO_SILK]  65.56,57.67 0 bottom
CLEAN442  [1X01_SMD_3.25X0.85MM_NO_SILK]  65.56,56.4 0 bottom
CLEAN443  [1X01_SMD_3.25X0.85MM_NO_SILK]  65.56,55.13 0 bottom
CLEAN444  [1X01_SMD_3.25X0.85MM_NO_SILK]  65.56,53.86 0 bottom
CLEAN445  [1X01_SMD_3.25X0.85MM_NO_SILK]  65.56,52.59 0 bottom
CLEAN446  [1X01_SMD_3.25X0.85MM_NO_SILK]  65.56,51.32 0 bottom
CLEAN447  [1X01_SMD_3.25X0.85MM_NO_SILK]  65.56,50.05 0 bottom
CLEAN448  [1X01_SMD_3.25X0.85MM_NO_SILK]  65.56,48.78 0 bottom
CLEAN449  [1X01_SMD_3.25X0.85MM_NO_SILK]  65.56,47.51 0 bottom
CLEAN450  [1X01_SMD_3.25X0.85MM_NO_SILK]  65.56,46.24 0 bottom
CLEAN451  [1X01_SMD_3.25X0.85MM_NO_SILK]  65.56,44.97 0 bottom
CLEAN452  [1X01_SMD_3.25X0.85MM_NO_SILK]  65.56,43.7 0 bottom
CLEAN453  [1X01_SMD_3.25X0.85MM_NO_SILK]  65.56,42.43 0 bottom
CLEAN454  [1X01_SMD_3.25X0.85MM_NO_SILK]  65.56,41.16 0 bottom
CLEAN455  [1X01_SMD_3.25X0.85MM_NO_SILK]  65.56,39.89 0 bottom
CLEAN456  [1X01_SMD_3.25X0.85MM_NO_SILK]  65.56,38.62 0 bottom
CLEAN457  [1X01_SMD_3.25X0.85MM_NO_SILK]  65.56,37.35 0 bottom
CLEAN458  [1X01_SMD_3.25X0.85MM_NO_SILK]  65.56,36.08 0 bottom
CLEAN459  [1X01_SMD_3.25X0.85MM_NO_SILK]  65.56,34.81 0 bottom
CLEAN460  [1X01_SMD_3.25X0.85MM_NO_SILK]  65.56,33.54 0 bottom
CLEAN461  [1X01_SMD_3.25X0.85MM_NO_SILK]  65.56,32.27 0 bottom
CLEAN462  [1X01_SMD_3.25X0.85MM_NO_SILK]  65.56,31 0 bottom
CLEAN463  [1X01_SMD_3.25X0.85MM_NO_SILK]  65.56,29.73 0 bottom
CLEAN464  [1X01_SMD_3.25X0.85MM_NO_SILK]  65.56,28.46 0 bottom
CLEAN465  [1X01_SMD_3.25X0.85MM_NO_SILK]  65.56,27.19 0 bottom
CLEAN466  [1X01_SMD_3.25X0.85MM_NO_SILK]  65.56,25.92 0 bottom
CLEAN467  [1X01_SMD_3.25X0.85MM_NO_SILK]  65.56,24.65 0 bottom
CLEAN468  [1X01_SMD_3.25X0.85MM_NO_SILK]  65.56,23.38 0 bottom
CLEAN469  [1X01_SMD_3.25X0.85MM_NO_SILK]  65.56,22.11 0 bottom
CLEAN470  [1X01_SMD_3.25X0.85MM_NO_SILK]  65.56,20.84 0 bottom
CLEAN471  [1X01_SMD_3.25X0.85MM_NO_SILK]  65.56,19.57 0 bottom
CLEAN472  [1X01_SMD_3.25X0.85MM_NO_SILK]  65.56,18.3 0 bottom
CLEAN473  [1X01_SMD_3.25X0.85MM_NO_SILK]  65.56,17.03 0 bottom
CLEAN474  [1X01_SMD_3.25X0.85MM_NO_SILK]  65.56,15.76 0 bottom
CLEAN475  [1X01_SMD_3.25X0.85MM_NO_SILK]  65.56,14.49 0 bottom
CLEAN476  [1X01_SMD_3.25X0.85MM_NO_SILK]  65.56,13.22 0 bottom
CLEAN477  [1X01_SMD_3.25X0.85MM_NO_SILK]  65.56,11.95 0 bottom
CLEAN478  [1X01_SMD_3.25X0.85MM_NO_SILK]  65.56,10.68 0 bottom
CLEAN479  [1X01_SMD_3.25X0.85MM_NO_SILK]  65.56,9.41 0 bottom
CLEAN480  [1X01_SMD_3.25X0.85MM_NO_SILK]  6.42,84.31 0 bottom
CLEAN481  [1X01_SMD_3.25X0.85MM_NO_SILK]  6.42,83.04 0 bottom
CLEAN482  [1X01_SMD_3.25X0.85MM_NO_SILK]  6.42,81.77 0 bottom
CLEAN483  [1X01_SMD_3.25X0.85MM_NO_SILK]  6.42,80.5 0 bottom
CLEAN484  [1X01_SMD_3.25X0.85MM_NO_SILK]  6.42,79.23 0 bottom
CLEAN485  [1X01_SMD_3.25X0.85MM_NO_SILK]  6.42,77.96 0 bottom
CLEAN486  [1X01_SMD_3.25X0.85MM_NO_SILK]  6.42,76.69 0 bottom
CLEAN487  [1X01_SMD_3.25X0.85MM_NO_SILK]  6.42,75.42 0 bottom
CLEAN488  [1X01_SMD_3.25X0.85MM_NO_SILK]  6.42,74.15 0 bottom
CLEAN489  [1X01_SMD_3.25X0.85MM_NO_SILK]  6.42,72.88 0 bottom
CLEAN490  [1X01_SMD_3.25X0.85MM_NO_SILK]  6.42,71.61 0 bottom
CLEAN491  [1X01_SMD_3.25X0.85MM_NO_SILK]  6.42,70.34 0 bottom
CLEAN492  [1X01_SMD_3.25X0.85MM_NO_SILK]  6.42,69.07 0 bottom
CLEAN493  [1X01_SMD_3.25X0.85MM_NO_SILK]  6.42,67.8 0 bottom
CLEAN494  [1X01_SMD_3.25X0.85MM_NO_SILK]  6.42,66.53 0 bottom
CLEAN495  [1X01_SMD_3.25X0.85MM_NO_SILK]  6.42,65.26 0 bottom
CLEAN496  [1X01_SMD_3.25X0.85MM_NO_SILK]  6.42,63.99 0 bottom
CLEAN497  [1X01_SMD_3.25X0.85MM_NO_SILK]  6.42,62.72 0 bottom
CLEAN498  [1X01_SMD_3.25X0.85MM_NO_SILK]  6.42,61.45 0 bottom
CLEAN499  [1X01_SMD_3.25X0.85MM_NO_SILK]  6.42,60.18 0 bottom
CLEAN500  [1X01_SMD_3.25X0.85MM_NO_SILK]  6.42,58.91 0 bottom
CLEAN501  [1X01_SMD_3.25X0.85MM_NO_SILK]  6.42,57.64 0 bottom
CLEAN502  [1X01_SMD_3.25X0.85MM_NO_SILK]  6.42,56.37 0 bottom
CLEAN503  [1X01_SMD_3.25X0.85MM_NO_SILK]  6.42,55.1 0 bottom
CLEAN504  [1X01_SMD_3.25X0.85MM_NO_SILK]  6.42,53.83 0 bottom
CLEAN505  [1X01_SMD_3.25X0.85MM_NO_SILK]  6.42,52.56 0 bottom
CLEAN506  [1X01_SMD_3.25X0.85MM_NO_SILK]  6.42,51.29 0 bottom
CLEAN507  [1X01_SMD_3.25X0.85MM_NO_SILK]  6.42,50.02 0 bottom
CLEAN508  [1X01_SMD_3.25X0.85MM_NO_SILK]  6.42,48.75 0 bottom
CLEAN509  [1X01_SMD_3.25X0.85MM_NO_SILK]  6.42,47.48 0 bottom
CLEAN510  [1X01_SMD_3.25X0.85MM_NO_SILK]  6.42,46.21 0 bottom
CLEAN511  [1X01_SMD_3.25X0.85MM_NO_SILK]  6.42,44.94 0 bottom
CLEAN512  [1X01_SMD_3.25X0.85MM_NO_SILK]  6.42,43.67 0 bottom
CLEAN513  [1X01_SMD_3.25X0.85MM_NO_SILK]  6.42,42.4 0 bottom
CLEAN514  [1X01_SMD_3.25X0.85MM_NO_SILK]  6.42,41.13 0 bottom
CLEAN515  [1X01_SMD_3.25X0.85MM_NO_SILK]  6.42,39.86 0 bottom
CLEAN516  [1X01_SMD_3.25X0.85MM_NO_SILK]  6.42,38.59 0 bottom
CLEAN517  [1X01_SMD_3.25X0.85MM_NO_SILK]  6.42,37.32 0 bottom
CLEAN518  [1X01_SMD_3.25X0.85MM_NO_SILK]  6.42,36.05 0 bottom
CLEAN519  [1X01_SMD_3.25X0.85MM_NO_SILK]  6.42,34.78 0 bottom
CLEAN520  [1X01_SMD_3.25X0.85MM_NO_SILK]  6.42,33.51 0 bottom
CLEAN521  [1X01_SMD_3.25X0.85MM_NO_SILK]  6.42,32.24 0 bottom
CLEAN522  [1X01_SMD_3.25X0.85MM_NO_SILK]  6.42,30.97 0 bottom
CLEAN523  [1X01_SMD_3.25X0.85MM_NO_SILK]  6.42,29.7 0 bottom
CLEAN524  [1X01_SMD_3.25X0.85MM_NO_SILK]  6.42,28.43 0 bottom
CLEAN525  [1X01_SMD_3.25X0.85MM_NO_SILK]  6.42,27.16 0 bottom
CLEAN526  [1X01_SMD_3.25X0.85MM_NO_SILK]  6.42,25.89 0 bottom
CLEAN527  [1X01_SMD_3.25X0.85MM_NO_SILK]  6.42,24.62 0 bottom
CLEAN528  [1X01_SMD_3.25X0.85MM_NO_SILK]  6.42,23.35 0 bottom
CLEAN529  [1X01_SMD_3.25X0.85MM_NO_SILK]  6.42,22.08 0 bottom
CLEAN530  [1X01_SMD_3.25X0.85MM_NO_SILK]  6.42,20.81 0 bottom
CLEAN531  [1X01_SMD_3.25X0.85MM_NO_SILK]  6.42,19.54 0 bottom
CLEAN532  [1X01_SMD_3.25X0.85MM_NO_SILK]  6.42,18.27 0 bottom
CLEAN533  [1X01_SMD_3.25X0.85MM_NO_SILK]  6.42,17 0 bottom
CLEAN534  [1X01_SMD_3.25X0.85MM_NO_SILK]  6.42,15.73 0 bottom
CLEAN535  [1X01_SMD_3.25X0.85MM_NO_SILK]  6.42,14.46 0 bottom
CLEAN536  [1X01_SMD_3.25X0.85MM_NO_SILK]  6.42,13.19 0 bottom
CLEAN537  [1X01_SMD_3.25X0.85MM_NO_SILK]  6.42,11.92 0 bottom
CLEAN538  [1X01_SMD_3.25X0.85MM_NO_SILK]  6.42,10.65 0 bottom
CLEAN539  [1X01_SMD_3.25X0.85MM_NO_SILK]  6.42,9.38 0 bottom
CLEAN540  [1X01_SMD_3.25X0.85MM_NO_SILK]  40.86,89.49 270 bottom
CLEAN541  [1X01_SMD_3.25X0.85MM_NO_SILK]  42.13,89.49 270 bottom
CLEAN542  [1X01_SMD_3.25X0.85MM_NO_SILK]  43.4,89.49 270 bottom
CLEAN543  [1X01_SMD_3.25X0.85MM_NO_SILK]  44.67,89.49 270 bottom
CLEAN544  [1X01_SMD_3.25X0.85MM_NO_SILK]  45.94,89.49 270 bottom
CLEAN545  [1X01_SMD_3.25X0.85MM_NO_SILK]  47.21,89.49 270 bottom
CLEAN546  [1X01_SMD_3.25X0.85MM_NO_SILK]  48.48,89.49 270 bottom
CLEAN547  [1X01_SMD_3.25X0.85MM_NO_SILK]  49.75,89.49 270 bottom
CLEAN548  [1X01_SMD_3.25X0.85MM_NO_SILK]  51.02,89.49 270 bottom
CLEAN549  [1X01_SMD_3.25X0.85MM_NO_SILK]  52.29,89.49 270 bottom
CLEAN550  [1X01_SMD_3.25X0.85MM_NO_SILK]  40.85,93.72 270 bottom
CLEAN551  [1X01_SMD_3.25X0.85MM_NO_SILK]  42.12,93.72 270 bottom
CLEAN552  [1X01_SMD_3.25X0.85MM_NO_SILK]  43.39,93.72 270 bottom
CLEAN553  [1X01_SMD_3.25X0.85MM_NO_SILK]  44.66,93.72 270 bottom
CLEAN554  [1X01_SMD_3.25X0.85MM_NO_SILK]  45.93,93.72 270 bottom
CLEAN555  [1X01_SMD_3.25X0.85MM_NO_SILK]  47.2,93.72 270 bottom
CLEAN556  [1X01_SMD_3.25X0.85MM_NO_SILK]  48.47,93.72 270 bottom
CLEAN557  [1X01_SMD_3.25X0.85MM_NO_SILK]  49.74,93.72 270 bottom
CLEAN558  [1X01_SMD_3.25X0.85MM_NO_SILK]  51.01,93.72 270 bottom
CLEAN559  [1X01_SMD_3.25X0.85MM_NO_SILK]  52.28,93.72 270 bottom
CLEAN560  [1X01_SMD_3.25X0.85MM_NO_SILK]  20.71,93.65 270 bottom
CLEAN561  [1X01_SMD_3.25X0.85MM_NO_SILK]  21.98,93.65 270 bottom
CLEAN562  [1X01_SMD_3.25X0.85MM_NO_SILK]  23.25,93.65 270 bottom
CLEAN563  [1X01_SMD_3.25X0.85MM_NO_SILK]  24.52,93.65 270 bottom
CLEAN564  [1X01_SMD_3.25X0.85MM_NO_SILK]  25.79,93.65 270 bottom
CLEAN565  [1X01_SMD_3.25X0.85MM_NO_SILK]  27.06,93.65 270 bottom
CLEAN566  [1X01_SMD_3.25X0.85MM_NO_SILK]  28.33,93.65 270 bottom
CLEAN567  [1X01_SMD_3.25X0.85MM_NO_SILK]  29.6,93.65 270 bottom
CLEAN568  [1X01_SMD_3.25X0.85MM_NO_SILK]  30.87,93.65 270 bottom
CLEAN569  [1X01_SMD_3.25X0.85MM_NO_SILK]  32.14,93.65 270 bottom
CLEAN570  [1X01_SMD_3.25X0.85MM_NO_SILK]  20.71,89.42 270 bottom
CLEAN571  [1X01_SMD_3.25X0.85MM_NO_SILK]  21.98,89.42 270 bottom
CLEAN572  [1X01_SMD_3.25X0.85MM_NO_SILK]  23.25,89.42 270 bottom
CLEAN573  [1X01_SMD_3.25X0.85MM_NO_SILK]  24.52,89.42 270 bottom
CLEAN574  [1X01_SMD_3.25X0.85MM_NO_SILK]  25.79,89.42 270 bottom
CLEAN575  [1X01_SMD_3.25X0.85MM_NO_SILK]  27.06,89.42 270 bottom
CLEAN576  [1X01_SMD_3.25X0.85MM_NO_SILK]  28.33,89.42 270 bottom
CLEAN577  [1X01_SMD_3.25X0.85MM_NO_SILK]  29.6,89.42 270 bottom
CLEAN578  [1X01_SMD_3.25X0.85MM_NO_SILK]  30.87,89.42 270 bottom
CLEAN579  [1X01_SMD_3.25X0.85MM_NO_SILK]  32.14,89.42 270 bottom
CLEAN580  [1X01_SMD_3.25X0.85MM_NO_SILK]  40.86,5.79 270 bottom
CLEAN581  [1X01_SMD_3.25X0.85MM_NO_SILK]  42.13,5.79 270 bottom
CLEAN582  [1X01_SMD_3.25X0.85MM_NO_SILK]  43.4,5.79 270 bottom
CLEAN583  [1X01_SMD_3.25X0.85MM_NO_SILK]  44.67,5.79 270 bottom
CLEAN584  [1X01_SMD_3.25X0.85MM_NO_SILK]  45.94,5.79 270 bottom
CLEAN585  [1X01_SMD_3.25X0.85MM_NO_SILK]  47.21,5.79 270 bottom
CLEAN586  [1X01_SMD_3.25X0.85MM_NO_SILK]  48.48,5.79 270 bottom
CLEAN587  [1X01_SMD_3.25X0.85MM_NO_SILK]  49.75,5.79 270 bottom
CLEAN588  [1X01_SMD_3.25X0.85MM_NO_SILK]  51.02,5.79 270 bottom
CLEAN589  [1X01_SMD_3.25X0.85MM_NO_SILK]  52.29,5.79 270 bottom
CLEAN590  [1X01_SMD_3.25X0.85MM_NO_SILK]  20.72,5.79 270 bottom
CLEAN591  [1X01_SMD_3.25X0.85MM_NO_SILK]  21.99,5.79 270 bottom
CLEAN592  [1X01_SMD_3.25X0.85MM_NO_SILK]  23.26,5.79 270 bottom
CLEAN593  [1X01_SMD_3.25X0.85MM_NO_SILK]  24.53,5.79 270 bottom
CLEAN594  [1X01_SMD_3.25X0.85MM_NO_SILK]  25.8,5.79 270 bottom
CLEAN595  [1X01_SMD_3.25X0.85MM_NO_SILK]  27.07,5.79 270 bottom
CLEAN596  [1X01_SMD_3.25X0.85MM_NO_SILK]  28.34,5.79 270 bottom
CLEAN597  [1X01_SMD_3.25X0.85MM_NO_SILK]  29.61,5.79 270 bottom
CLEAN598  [1X01_SMD_3.25X0.85MM_NO_SILK]  30.88,5.79 270 bottom
CLEAN599  [1X01_SMD_3.25X0.85MM_NO_SILK]  32.15,5.79 270 bottom